# EAGLE design N64_Tx_V4.0 (EAGLE 7.6.0)
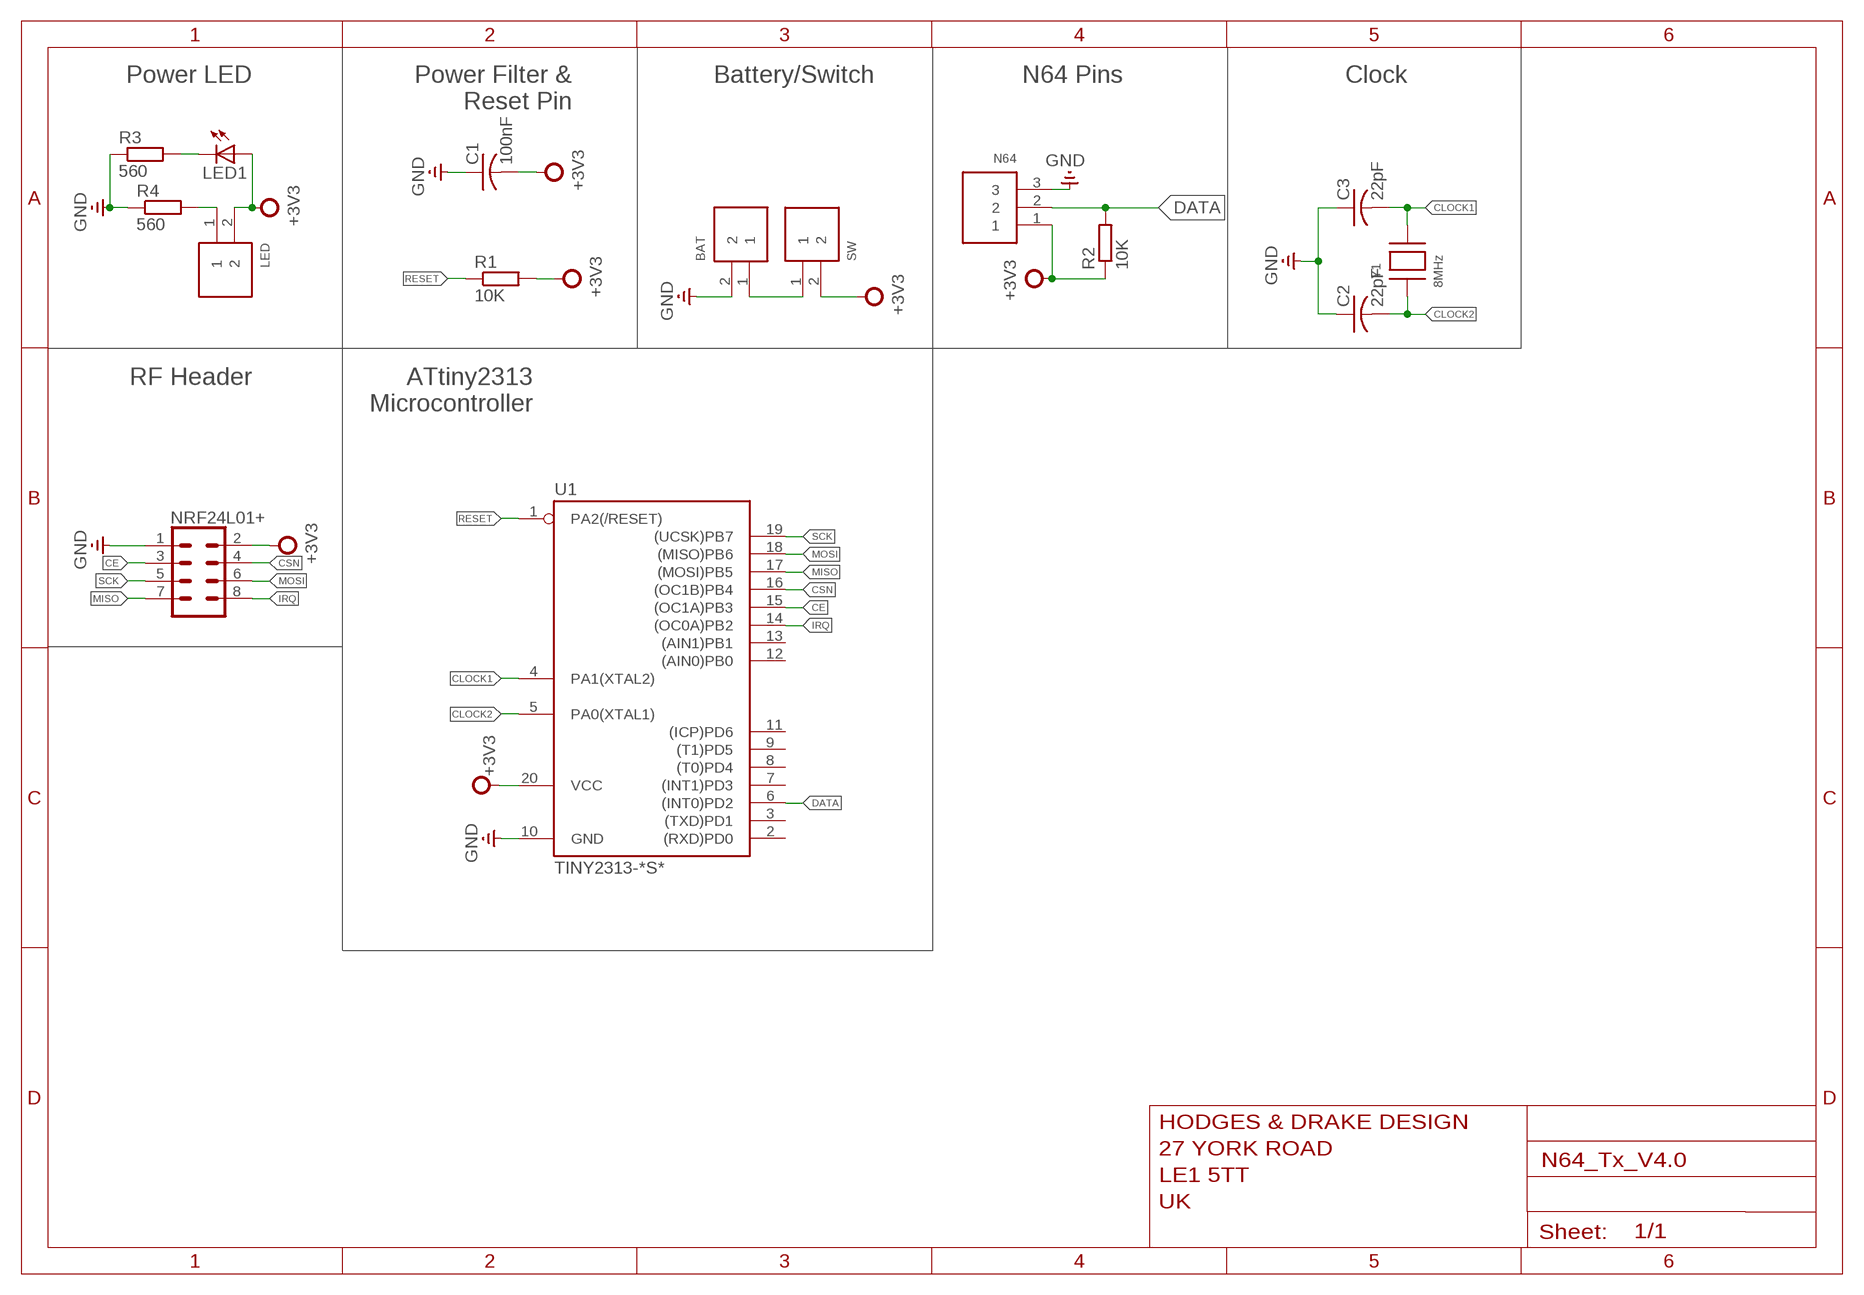
[diagram p0: schematic, sheet 1]

## Parts
BAT  2PIN  [B2B-PH-K-S]
C1  100nF  C-USC0603  [C0603]
C2  22pF  C-USC0603  [C0603]
C3  22pF  C-USC0603  [C0603]
LED  2PIN  [B2B-PH-K-S]
LED1  LEDCHIPLED_0805  [CHIPLED_0805]
N64  3PIN  [B3B-PH-K-S]
NRF24L01+  CONN_04X2  [2X4]
R1  10K  R-0603  [R0603]
R2  10K  R-0603  [R0603]
R3  560  R-0603  [R0603]
R4  560  R-0603  [R0603]
SW  2PIN  [B2B-PH-K-S]
U1  TINY2313-*S*  [SO20L$]
Y1  8MHz  QANTEK_SMD_CRYSTAL  [QANTEK_SMD_CRYSTAL_PACK]

## Nets
+3V3: C1.2 LED1.A LED.2 N64.1 NRF24L01+.2 R1.2 R2.1 SW.2 U1.20(VCC)
CE: NRF24L01+.3 U1.15((OC1A)PB3)
CLOCK1: C3.2 U1.4(PA1(XTAL2)) Y1.P$2(X2)
CLOCK2: C2.2 U1.5(PA0(XTAL1)) Y1.P$1(X1)
CSN: NRF24L01+.4 U1.16((OC1B)PB4)
DATA: N64.2 R2.2 U1.6((INT0)PD2)
GND: BAT.2 C1.1 C2.1 C3.1 N64.3 NRF24L01+.1 R3.1 R4.1 U1.10(GND)
IRQ: NRF24L01+.8 U1.14((OC0A)PB2)
MISO: NRF24L01+.7 U1.17((MOSI)PB5)
MOSI: NRF24L01+.6 U1.18((MISO)PB6)
N$1: BAT.1 SW.1
N$2: LED1.C R3.2
N$3: LED.1 R4.2
RESET: R1.1 U1.1(PA2(/RESET))
SCK: NRF24L01+.5 U1.19((UCSK)PB7)
Unconnected: U1.2((RXD)PD0) U1.3((TXD)PD1) U1.7((INT1)PD3) U1.8((T0)PD4) U1.9((T1)PD5) U1.11((ICP)PD6) U1.12((AIN0)PB0) U1.13((AIN1)PB1)

## Notes on the sheet
- Power LED
- Power Filter &
  Reset Pin
- Battery/Switch | N64 Pins | Clock
- RF Header
- ATtiny2313
  Microcontroller

## Library data of the parts
BAT LED SW = jst_eph:2PIN
C1-C3 = rcl:C-US: CAPACITOR, American symbol
LED1 = adafruit:LED: LED OSRAM: - CHIPLED LG R971, LG N971, LY N971, LG Q971, LY Q971, LO R971, LY R971 LH N974, LH R974 LS Q976, LO Q976, LY Q976 LO Q996 - Hyper CHIPLED LW Q18S LB Q993, LB Q99A, LB R99A - SideLED LS A670, LO A670, LY A670, LG A670, LP A670 LB A673, LV A673, LT A673, LW A673 LH A674 LY A675 LS A676, LA A676, LO A676, LY A676, LW A676 LS A679, LY A679, LG A679 - Hyper Micro SIDELED® LS Y876, LA Y876, LO Y876, LY Y876 LT Y87S - SmartLED LW L88C, LW L88S LB L89C, LB L89S, LG L890 LS L89K, LO L89K, LY L89K LS L896, LA L896, LO L896, LY L896 - TOPLED LS T670, LO T670, LY T670, LG T670, LP T670 LSG T670, LSP T670, LSY T670, LOP T670, LYG T670 LG T671, LOG T671, LSG T671 LB T673, LV T673, LT T673, LW T673 LH T674 LS T676, LA T676, LO T676, LY T676, LB T676, LH T676, LSB T676, LW T676 LB T67C, LV T67C, LT T67C, LS T67K, LO T67K, LY T67K, LW E67C LS E67B, LA E67B, LO E67B, LY E67B, LB E67C, LV E67C, LT E67C LW T67C LS T679, LY T679, LG T679 LS T770, LO T770, LY T770, LG T770, LP T770 LB T773, LV T773, LT T773, LW T773 LH T774 LS E675, LA E675, LY E675, LS T675 LS T776, LA T776, LO T776, LY T776, LB T776 LHGB T686 LT T68C, LB T68C - Hyper Mini TOPLED® LB M676 - Mini TOPLED Santana® LG M470 LS M47K, LO M47K, LY M47K Source: http://www.osram.convergy.de/
N64 = jst_eph:3PIN
NRF24L01+ = SparkFun-Connectors:CONN_04X2: Multi connection point. Often used as Generic Header-pin footprint for 0.1 inch spaced/style header connections On any of the 0.1 inch spaced packages, you can populate with these: Break Away Headers - Straight <https://www.sparkfun.com/products/116> (PRT-00116) Break Away Male Headers - Right Angle <https://www.sparkfun.com/products/553> (PRT-00553) Female Headers <https://www.sparkfun.com/products/115> (PRT-00115) Break Away Headers - Machine Pin <https://www.sparkfun.com/products/117> (PRT-00117) Break Away Female Headers - Swiss Machine Pin <https://www.sparkfun.com/products/743> (PRT-00743)
R1-R4 = quantum-sensor:R: Resistor
U1 = avr-6:TINY2313*: Atmel Tiny2313 2K Flash, 128 bytes EEPROM, 128 bytes RAM
Y1 = Saifs_lib:QANTEK_SMD_CRYSTAL

## Board
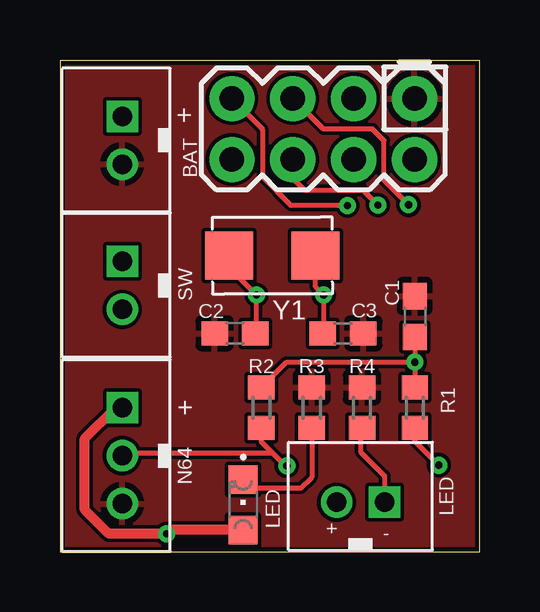
[diagram p1: board, top side]
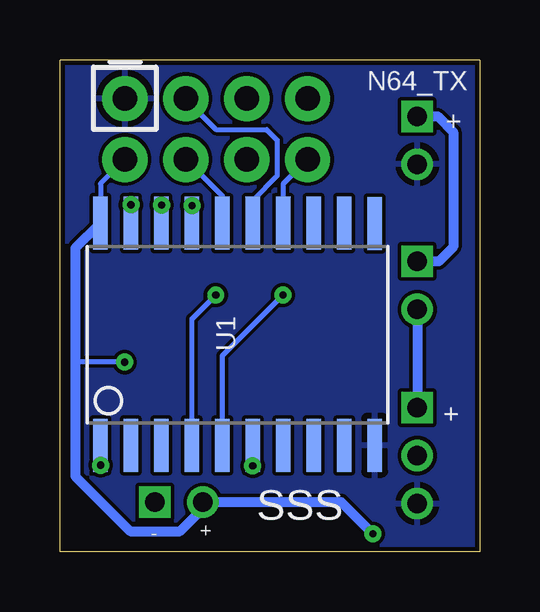
[diagram p2: board, bottom side, seen from below]

Size 17.5 x 20.5 mm. Coordinates in mm from the lower left corner, seen from the top.
Outline: 0,0 17.5,0 17.5,20.5 0,20.5 0,0
Copper layers (1*16): Top 0.035mm / dielectric 1.5mm / Bottom 0.035mm
Design rules "default *": minimum track width 6mil, minimum drill 0.35mm, track to track 6mil, track to pad 6mil, pad to pad 6mil, via to via 6mil, smd to smd 6mil, copper to edge 0.2mm, drill to drill 6mil, minimum pad ring 10mil, minimum via ring 8mil, stop-mask expansion 4mil, vias tented up to drill 0mil, thermal gap 10mil

### Footprints (pad centres in the part's own frame; a part is rotated, then mirrored left to right if it is on the bottom)
B2B-PH-K-S = drill 0.813 square: 1 2,0 | drill 0.813: 2 0,0
C0603 = smd 1.1 x 1: 1 -0.85,0; 2 0.85,0
CHIPLED_0805 = smd 1.2 x 1.2: A 0,-1.05; C 0,1.05
B3B-PH-K-S = drill 0.813 square: 1 2,0 | drill 0.813: 2 0,0; 3 -2,0
2X4 = drill 1.016 pad 1.88: 1 -3.81,-1.27; 2 -3.81,1.27; 3 -1.27,-1.27; 4 -1.27,1.27; 5 1.27,-1.27; 6 1.27,1.27; 7 3.81,-1.27; 8 3.81,1.27
R0603 = smd 1 x 1.1: 1 -0.85,0; 2 0.85,0
SO20L$ = smd 0.61 x 2.21: 1 -5.715,-4.636; 2 -4.445,-4.636; 3 -3.175,-4.636; 4 -1.905,-4.636; 5 -0.635,-4.636; 6 0.635,-4.636; 7 1.905,-4.636; 8 3.175,-4.636; 9 4.445,-4.636; 10 5.715,-4.636; 11 5.715,4.61; 12 4.445,4.636; 13 3.175,4.636; 14 1.905,4.636; 15 0.635,4.636; 16 -0.635,4.636; 17 -1.905,4.636; 18 -3.175,4.636; 19 -4.445,4.636; 20 -5.715,4.636
QANTEK_SMD_CRYSTAL_PACK = smd 2 x 2: P$1 -1.8,0; P$2 1.8,0

### Placement (x,y rotation side)
BAT  2.6,16.15 90 top
C1  14.8,9.8 270 top
C2  7.3,9.1 0 top
C3  11.8,9.1 180 top
LED  11.54,2.06 0 top
LED1  7.64,1.95 0 top
N64  2.6,4 90 top
NRF24L01+  10.98,17.62 180 top
R1  14.8,6 90 top
R2  8.4,6 270 top
R3  10.5,6 270 top
R4  12.6,6 270 top
SW  2.6,10.1 90 top
U1  10.09,9.07 0 bottom
Y1  8.86,12.34 0 top

### Tracks (layer width: path | path; a pad name or v marks a point on that pad's centre or on a via)
+3V3  (via drill 0.3)
  Top 0.2: v14.8,7.9 R1.2 | R2.1 9.45,7.9 v14.8,7.9 | C1.2 v14.8,7.9
  Top 0.406: N64.1 2.33,6 1.04,4.71 1.04,1.74 2.04,0.74 v4.45,0.74 4.61,0.9 LED1.A
  Bottom 0.2: NRF24L01+.2 15.8,15.34 U1.20 | v14.8,7.9 16.86,7.9 16.86,7.8
  Bottom 0.406: SW.2 N64.1 | U1.20 16.86,12.65 16.86,7.8 16.86,3.14 14.57,0.85 12.49,0.85 11.54,1.8 LED.2 5.77,2.06 v4.45,0.74
CE
  Bottom 0.2: NRF24L01+.3 12.25,18.85 11,17.6 8.88,17.6 8.44,17.16 8.44,15.67 9.46,14.65 U1.15
CLOCK1  (via drill 0.3)
  Top 0.2: Y1.P$2 10.66,11.04 v11,10.7 11,9.15 C3.2
  Bottom 0.2: U1.4 11.99,9.71 v11,10.7
CLOCK2  (via drill 0.3)
  Top 0.2: Y1.P$1 7.06,11.84 v8.2,10.7 8.2,9.15 C2.2
  Bottom 0.2: U1.5 10.72,8.18 v8.2,10.7
CSN
  Bottom 0.2: NRF24L01+.4 10.72,14.82 U1.16
DATA  (via drill 0.3)
  Top 0.2: v9.46,3.57 v9.47,3.58 9.4,3.58 8.87,4.11 | 8.87,4.11 8.4,4.58 R2.2 | N64.2 2.71,4.11 8.87,4.11
  Bottom 0.2: v9.46,3.57 U1.6
GND
  pour Top: 0,0 0,20.5 17.5,20.5 17.5,0
  pour Bottom: 0,0 0,20.5 17.5,20.5 17.5,0
IRQ
  Bottom 0.2: U1.14 8.19,15.34 NRF24L01+.8
MISO  (via drill 0.3)
  Top 0.2: NRF24L01+.7 8.44,17.62 8.44,15.63 9.64,14.43 v11.99,14.43
  Bottom 0.2: U1.17 11.99,14.23 12,14.24 11.99,14.25 v11.99,14.43
MOSI  (via drill 0.3)
  Top 0.2: NRF24L01+.6 9.71,15.56 10.19,15.08 12.63,15.08 v13.27,14.45
  Bottom 0.2: U1.18 v13.27,14.45
N$1
  Bottom 0.406: BAT.1 1.75,18.15 1.1,17.5 1.1,12.7 1.7,12.1 SW.1
N$2
  Top 0.2: R3.2 10.5,3.1 10.05,2.65 7.99,2.65 LED1.C
N$3
  Top 0.2: R4.2 12.54,5.09 12.54,4.16 13.54,3.16 LED.1
RESET  (via drill 0.3)
  Top 0.2: v15.8,3.6 14.8,4.6 R1.1
  Bottom 0.2: v15.8,3.6 U1.1
SCK  (via drill 0.3)
  Top 0.2: NRF24L01+.5 10.98,17.62 13.04,17.62 13.52,17.14 13.52,15.48 v14.54,14.46
  Bottom 0.2: U1.19 v14.54,14.46

### Text on the board
tPlace: + | + | LED | + | -
bPlace: N64_TX | + | + | SSS | + | -